# EAGLE design Vcc (EAGLE 6.5.0)
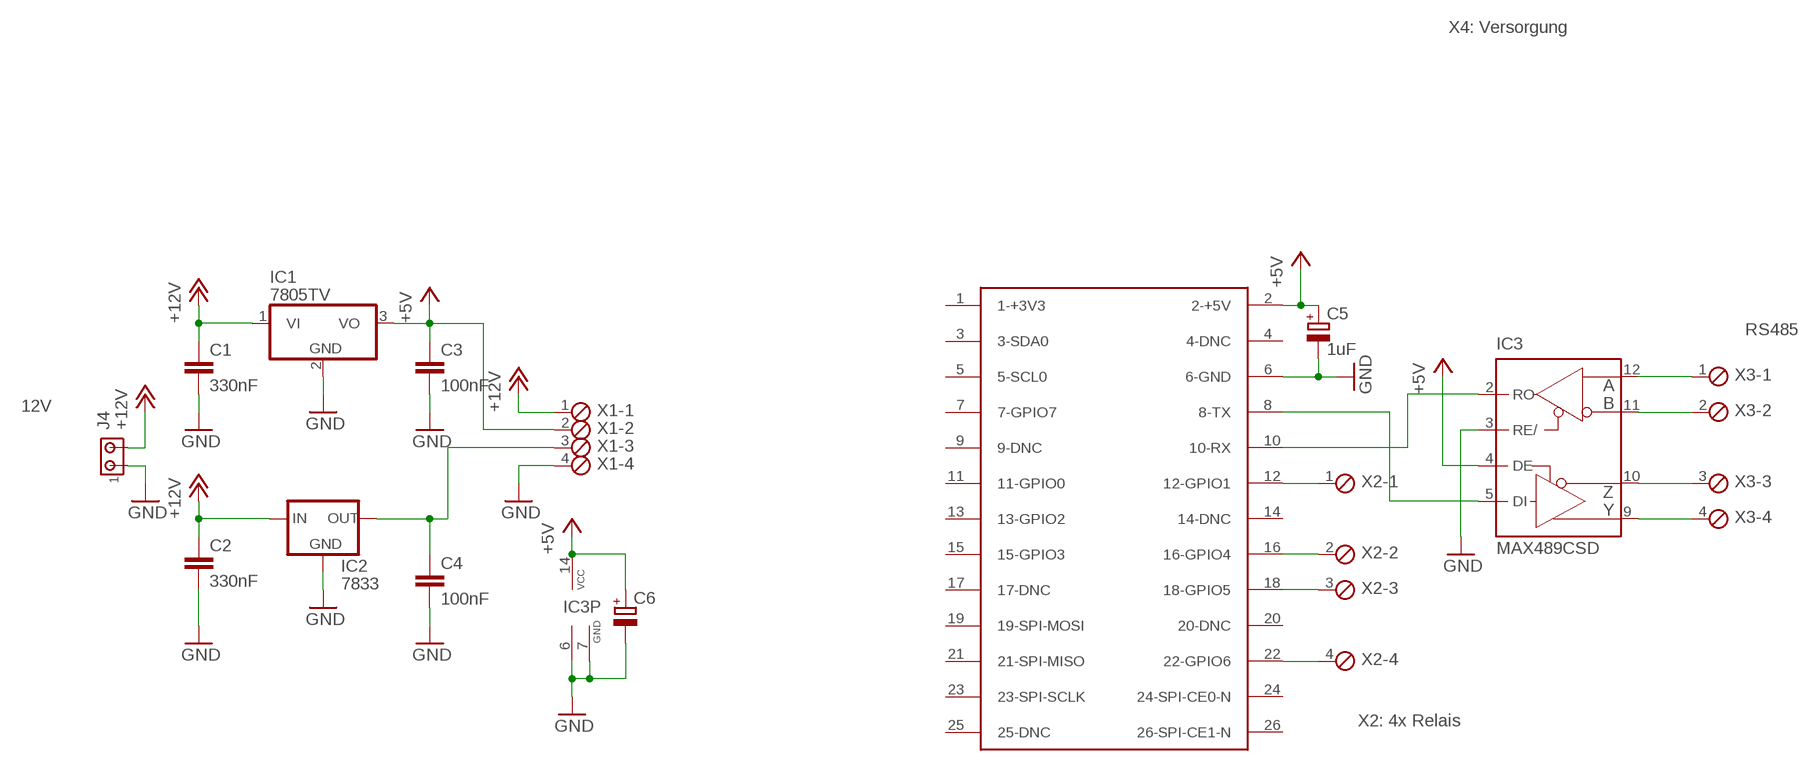
[diagram p0: schematic, sheet 1]

## Parts
C1  330nF  C-EU050-035X075  [C050-035X075]
C2  330nF  C-EU050-035X075  [C050-035X075]
C3  100nF  C-EU050-035X075  [C050-035X075]
C4  100nF  C-EU050-035X075  [C050-035X075]
C5  1uF  CPOL-EUE2.5-7  [E2,5-7]
C6  CPOL-EUE2.5-7  [E2,5-7]
IC1  7805TV  [TO220V]
IC2  7833  78XXS  [78XXS]
IC3  MAX489CSD  [SO14]
J4  MTA02-100  [10X02MTA]
U$1  RASPBERRY-PI  [RASPBERRY-PI]
X1  MPT4  [4POL254]
X2  MPT4  [4POL254]
X3  MPT4  [4POL254]

## Nets
+5V: C3.1 C5.+ C6.+ IC1.3(VO) IC3.4(DE) IC3.14(VCC) U$1.2(2-+5V) X1.2
+12V: C1.1 C2.1 IC1.1(VI) IC2.IN J4.2 X1.1
GND: C1.2 C2.2 C3.2 C4.2 C5.- C6.- IC1.2(GND) IC2.GND IC3.3(RE/) IC3.6(GND) IC3.7(GND) J4.1 U$1.6(6-GND) X1.4
N$1: U$1.18(18-GPIO5) X2.3
N$2: U$1.22(22-GPIO6) X2.4
N$3: IC3.11(B) X3.2
N$4: IC3.2(RO) U$1.10(10-RX)
N$5: IC3.5(DI) U$1.8(8-TX)
N$6: IC3.9(Y) X3.4
N$7: IC3.10(Z) X3.3
N$9: IC3.12(A) X3.1
N$10: U$1.16(16-GPIO4) X2.2
N$11: C4.1 IC2.OUT X1.3
N$12: U$1.12(12-GPIO1) X2.1
Unconnected: IC3.1(NC) IC3.8(NC) IC3.13(NC) U$1.1(1-+3V3) U$1.3(3-SDA0) U$1.4(4-DNC) U$1.5(5-SCL0) U$1.7(7-GPIO7) U$1.9(9-DNC) U$1.11(11-GPIO0) U$1.13(13-GPIO2) U$1.14(14-DNC) U$1.15(15-GPIO3) U$1.17(17-DNC) U$1.19(19-SPI-MOSI) U$1.20(20-DNC) U$1.21(21-SPI-MISO) U$1.23(23-SPI-SCLK) U$1.24(24-SPI-CE0-N) U$1.25(25-DNC) U$1.26(26-SPI-CE1-N)

## Notes on the sheet
- X4: Versorgung
- RS485
- 12V
- X2: 4x Relais

## Library data of the parts
C1-C4 = rcl:C-EU: CAPACITOR, European symbol
C5 C6 = HTL_RCL:CPOL-EU: POLARIZED CAPACITOR, European symbol
IC1 = linear:78*: Positive VOLTAGE REGULATOR Source: http://cache.national.com/ds/LM/LM78L05.pdf http://www.fairchildsemi.com/ds/LM/LM7805.pdf
IC2 = HTL_Spannungsregler:78XXS: VOLTAGE REGULATOR
IC3 = maxim:MAX489CSD: RS485 TRANSEIVER; MF: MAXIM; MPN: MAX489CSD; OC_FARNELL: 9724559; OC_NEWARK: 34C3923
J4 = con-amp:MTA02-100: AMP connector
U$1 = RaspberryPi:RASPBERRY-PI: Raspberry Pi Board <http://www.raspberrypi.org/> Jacques Lagnel V1.0 (beta) 2012 Board dimension: Forum 3D model <http://www.raspberrypi.org/forum/general-discussion/mechanical-profile-3d-models?value=3d%20model&type=1&include=1&search=1&ret=all> The GPIO Connector (P1): http://elinux.org/RPi_Low-level_peripherals
X1-X3 = con-phoenix-254:MPT4: PHOENIX CONNECTOR; OC_FARNELL: unknown; OC_NEWARK: unknown

## Board
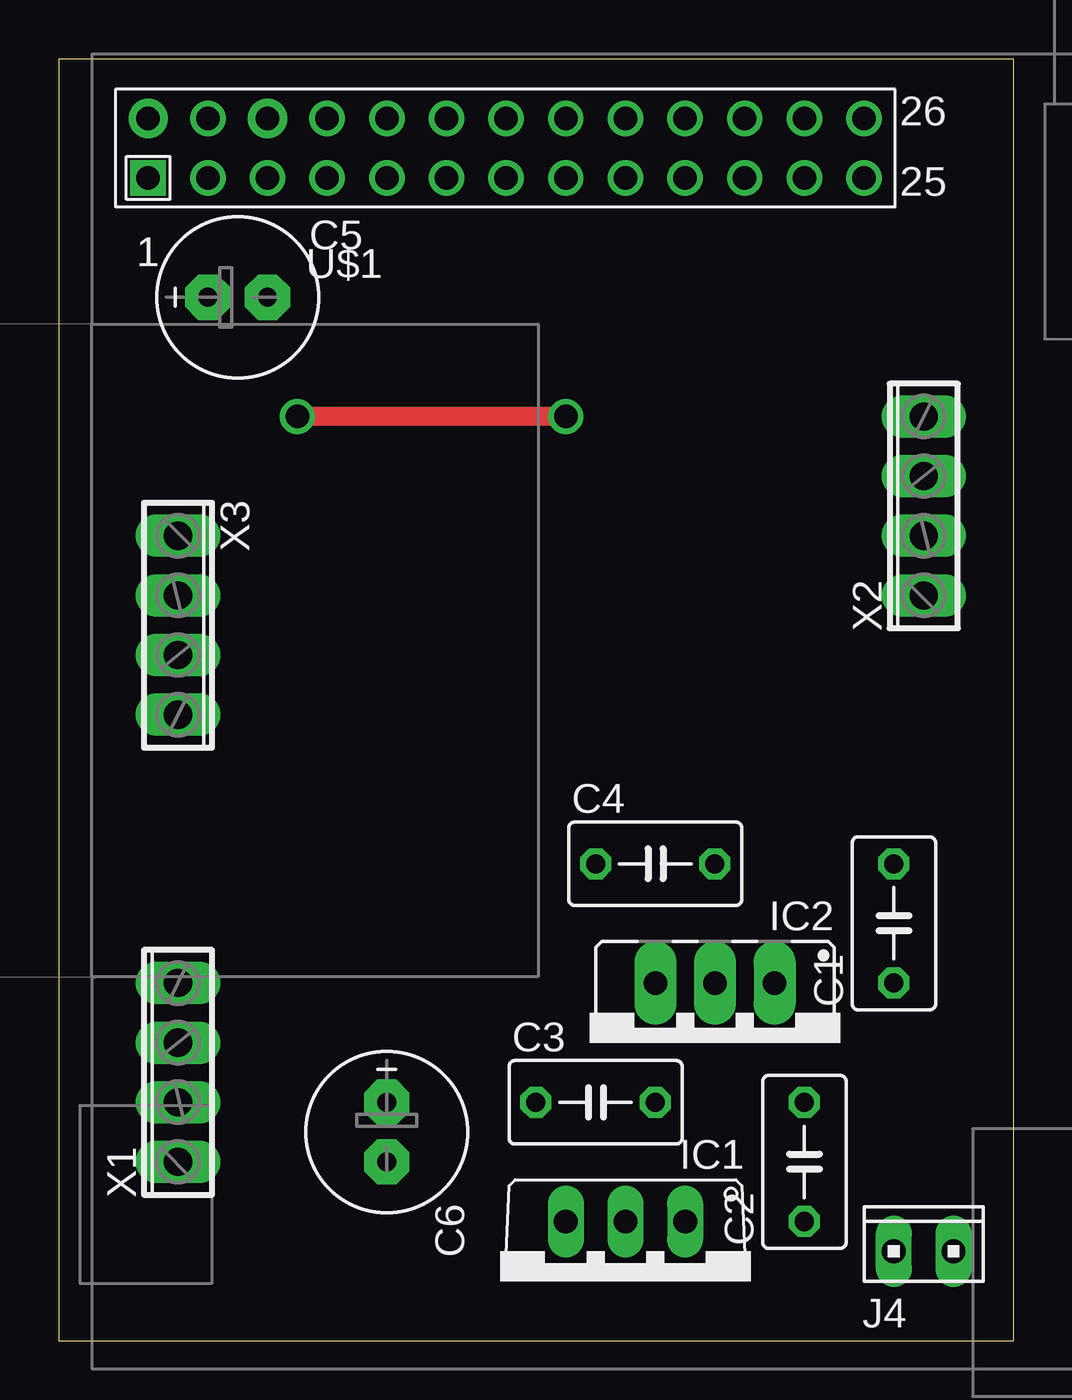
[diagram p1: board, top side]
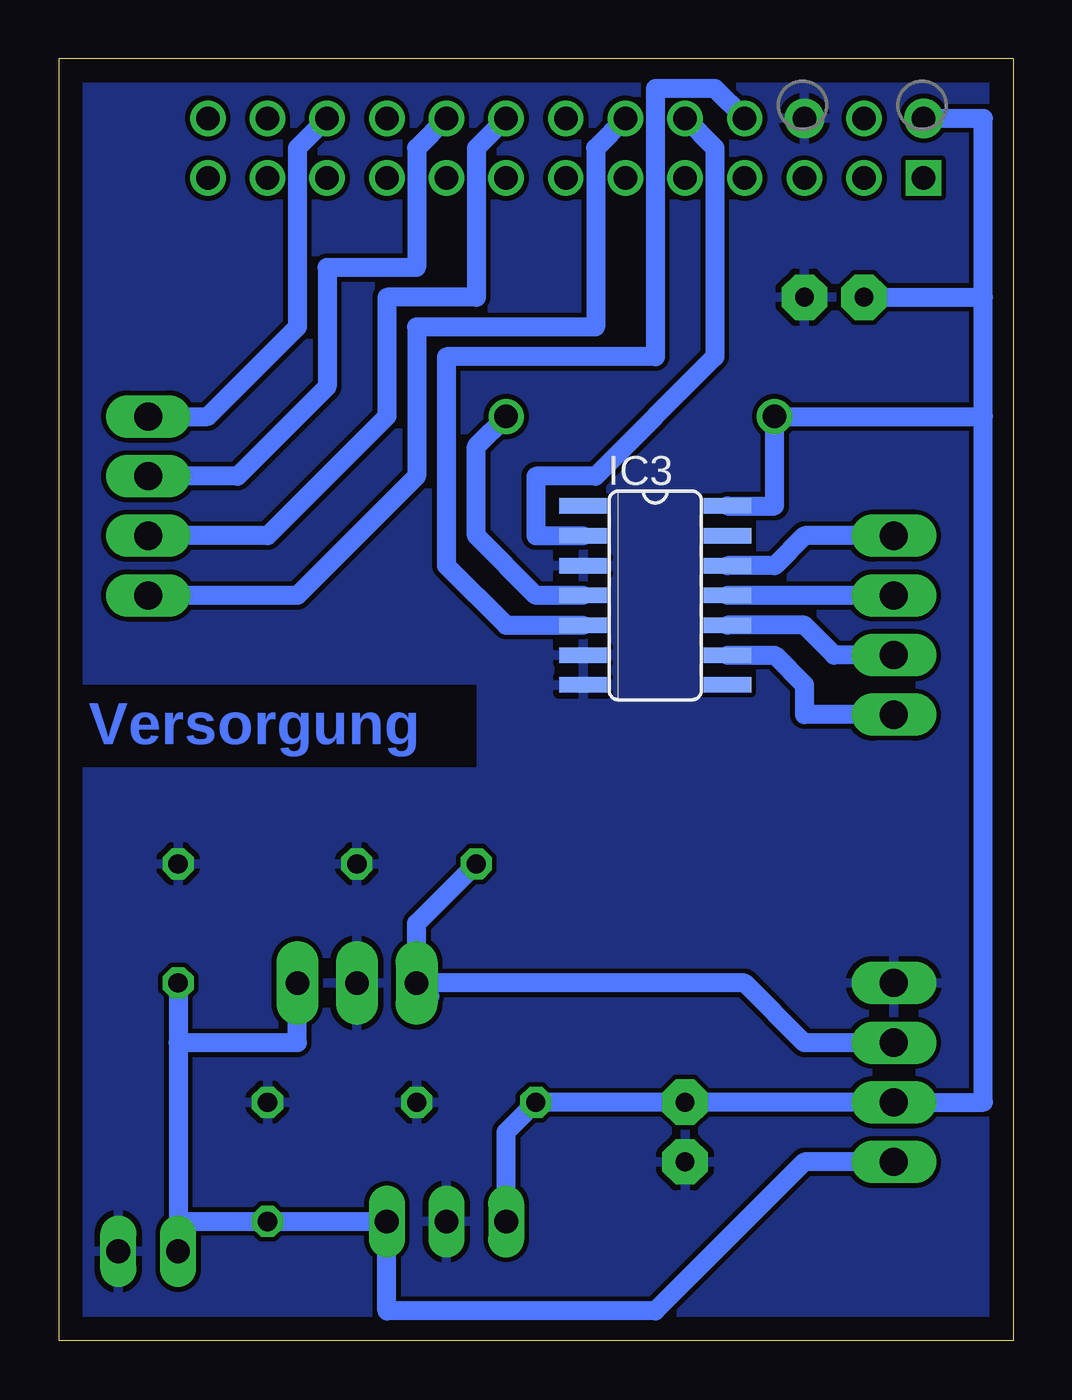
[diagram p2: board, bottom side, seen from below]

Size 40.64 x 54.61 mm. Coordinates in mm from the lower left corner, seen from the top.
Outline: 0,54.61 40.64,54.61 40.64,0 0,0 0,54.61
Copper layers (1*16): Top 0.035mm / dielectric 1.5mm / Bottom 0.035mm
Design rules "default": minimum track width 10mil, minimum drill 24mil, track to track 8mil, track to pad 8mil, pad to pad 8mil, via to via 8mil, smd to smd 8mil, copper to edge 40mil, drill to drill 8mil, minimum pad ring 10mil, minimum via ring 8mil, stop-mask expansion 4mil, vias tented up to drill 0mil, thermal gap 10mil
bRestrict: area 22.9,24.4 to 40.3,27.9

### Footprints (pad centres in the part's own frame; a part is rotated, then mirrored left to right if it is on the bottom)
C050-035X075 = drill 0.813 octagon: 1 -2.54,0; 2 2.54,0
E2,5-7 = drill 0.8 pad 1.93 octagon: + -1.27,0; - 1.27,0
TO220V = drill 1.016 long: 1 -2.54,-2.54; 2 0,-2.54; 3 2.54,-2.54
78XXS = drill 1 pad 1.778 long: GND 0,-2.54; IN -2.54,-2.54; OUT 2.54,-2.54
SO14 = smd 0.66 x 2.032: 1 -3.81,-3.073; 2 -2.54,-3.073; 3 -1.27,-3.073; 4 0,-3.073; 5 1.27,-3.073; 6 2.54,-3.073; 7 3.81,-3.073; 8 3.81,3.073; 9 2.54,3.073; 10 1.27,3.073; 11 0,3.073; 12 -1.27,3.073; 13 -2.54,3.073; 14 -3.81,3.073
10X02MTA = drill 1.016 long: 1 1.27,0; 2 -1.27,0
RASPBERRY-PI = drill 1 square: 1 0,0 | drill 1 pad 1.676: 2 0,2.54; 6 5.08,2.54 | drill 1: 3 2.54,0; 4 2.54,2.54; 5 5.08,0; 7 7.62,0; 8 7.62,2.54; 9 10.16,0; 10 10.16,2.54; 11 12.7,0; 12 12.7,2.54; 13 15.24,0; 14 15.24,2.54; 15 17.78,0; 16 17.78,2.54; 17 20.32,0; 18 20.32,2.54; 19 22.86,0; 20 22.86,2.54; 21 25.4,0; 22 25.4,2.54; 23 27.94,0; 24 27.94,2.54; 25 30.48,0; 26 30.48,2.54
4POL254 = drill 1.2 long: 1 -3.81,0; 2 -1.27,0; 3 1.27,0; 4 3.81,0

### Placement (x,y rotation side)
C1  35.56,17.78 90 top
C2  31.75,7.62 90 top
C3  22.86,10.16 0 top
C4  25.4,20.32 0 top
C5  7.62,44.45 0 top
C6  13.97,8.89 270 top
IC1  24.13,2.54 180 top
IC2  27.94,12.7 180 top
IC3  15.24,31.75 270 bottom
J4  36.83,3.81 0 top
U$1  3.81,49.53 0 top
X1  5.08,11.43 90 top
X2  36.83,35.56 90 top
X3  5.08,30.48 270 top

### Tracks (layer width: path | path; a pad name or v marks a point on that pad's centre or on a via)
+5V  (via drill 1)
  Top 0.813: v21.59,39.37 v10.16,39.37
  Bottom 0.813: IC1.3 21.59,8.89 C3.1 C6.+ X1.2 1.27,10.16 1.27,39.37 | U$1.2 1.27,52.07 1.27,44.45 | C5.+ 1.27,44.45 | IC3.14 10.16,35.56 v10.16,39.37 1.27,39.37 | IC3.4 20.32,31.75 22.86,34.29 22.86,38.1 v21.59,39.37 | 1.27,39.37 1.27,44.45
+12V
  Bottom 0.813: IC2.IN 30.48,12.7 35.56,12.7 | 35.56,5.08 C2.1 IC1.1 26.67,1.27 15.24,1.27 8.89,7.62 X1.1 | 35.56,12.7 35.56,5.08 | 35.56,5.08 J4.2 | C1.1 35.56,12.7
GND
  pour Bottom: 0,54.61 40.64,54.61 40.64,0 0,0
N$1
  Bottom 0.813: U$1.18 25.4,50.8 25.4,45.72 29.21,45.72 29.21,40.64 33.02,36.83 X2.3
N$2
  Bottom 0.813: U$1.22 30.48,50.8 30.48,43.18 34.29,39.37 X2.4
N$3
  Bottom 0.813: X3.2 IC3.11
N$4
  Bottom 0.813: U$1.10 12.7,50.8 12.7,41.91 17.78,36.83 20.32,36.83 20.32,34.29 IC3.2
N$5
  Bottom 0.813: U$1.8 12.7,53.34 15.24,53.34 15.24,41.91 24.13,41.91 24.13,33.02 21.59,30.48 IC3.5
N$6
  Bottom 0.813: IC3.9 10.16,29.21 8.89,27.94 8.89,26.67 X3.4
N$7
  Bottom 0.813: IC3.10 8.89,30.48 7.62,29.21 X3.3
N$9
  Bottom 0.813: IC3.12 10.16,33.02 8.89,34.29 X3.1
N$10
  Bottom 0.813: U$1.16 22.86,50.8 22.86,44.45 26.67,44.45 26.67,39.37 31.75,34.29 X2.2
N$11
  Bottom 0.813: IC2.OUT 25.4,17.78 C4.1 | 24.84,14.68 IC2.OUT | X1.3 8.89,12.7 11.43,15.24 IC2.OUT
N$12
  Bottom 0.813: U$1.12 17.78,50.8 17.78,43.18 25.4,43.18 25.4,36.83 30.48,31.75 X2.1

### Text on the board
Bottom: Versorgung